# Altium schematic sheet servo_receiver.SchDoc
size A4
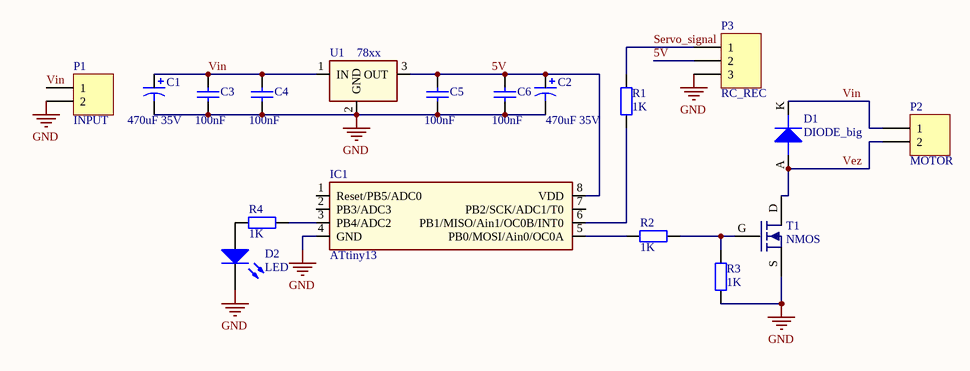
[diagram p0: servo_receiver.SchDoc]

## Parts
C1  470uF 35V  [cap_10x12]
C2  470uF 35V  [cap_10x12]
C3  100nF  [FP_0805_CAP_085]
C4  100nF  [FP_0805_CAP_085]
C5  100nF  [FP_0805_CAP_085]
C6  100nF  [FP_0805_CAP_085]
D1  DIODE_big  [DO-213AB_R]
D2  LED  [FP_0805_LED_RED]
IC1  ATtiny13  [WSON_n_SOIC8]
P1  INPUT  [HDR1X2]
P2  MOTOR  [HDR1X2]
P3  RC_REC  [HDR1X3]
R1  1K  [FP_0603_RES]
R2  1K  [FP_0603_RES]
R3  1K  [FP_0603_RES]
R4  1K  [FP_0603_RES]
T1  NMOS  [FET_SOT23]
U1  78xx  [SUPPLY_D2-PAK_2]

## Nets
GND: C1.N C2.N C3.1 C4.1 C5.2 C6.1 D2.2(K) IC1.4(GND) P1.2 P3.3 R3.1 T1.S U1.2(GND)
5V: C2.P C5.1 C6.2 IC1.8(VDD) P3.2 U1.3(OUT)
Servo_signal: P3.1 R1.2
Vez: D1.A P2.2 T1.D
Vin: C1.P C3.2 C4.2 D1.K P1.1 P2.1 U1.1(IN)
NetD2_1: D2.1(A) R4.1
NetIC1_3: IC1.3(PB4/ADC2) R4.2
NetIC1_5: IC1.5(PB0/MOSI/Ain0/OC0A) R2.1
NetIC1_6: IC1.6(PB1/MISO/Ain1/OC0B/INT0) R1.1
NetR2_2: R2.2 R3.2 T1.G

Not connected (* = marked no-connect by the designer): IC1 1(Reset/PB5/ADC0) 2(PB3/ADC3) 7(PB2/SCK/ADC1/T0)

## Library data of the parts
C1 C2 = CAP_ELECT: Polarized Capacitor; Value: 470uF 35V
C3-C6 = CAP: Capacitor; Value: 100nF
D2 = LED: Typical LED; pin to pad: 1>A 2>K
P1 P2 = Header 2: Header, 2-Pin; LatestRevisionDate: 17-Jul-2002; LatestRevisionNote: Re-released for DXP Platform.; Publisher: Altium Limited
P3 = Header 3: Header, 3-Pin; LatestRevisionDate: 17-Jul-2002; LatestRevisionNote: Re-released for DXP Platform.; Publisher: Altium Limited
R1-R4 = RES: Resistor; Value: 1K